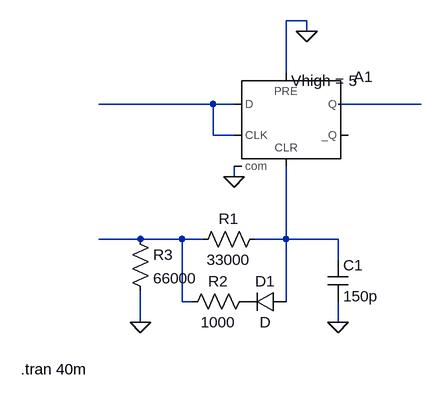
[diagram p0: schematic Draft3.asc]
Draft3.asc, the LTspice schematic file:
Version 4.1
SHEET 1 880 680
WIRE 496 -128 464 -128
WIRE 496 -112 496 -128
WIRE 464 -48 464 -128
WIRE 352 0 176 0
WIRE 384 0 352 0
WIRE 672 0 544 0
WIRE 352 48 352 0
WIRE 384 48 352 48
WIRE 384 112 384 96
WIRE 240 208 176 208
WIRE 304 208 240 208
WIRE 336 208 304 208
WIRE 464 208 464 96
WIRE 464 208 416 208
WIRE 544 208 464 208
WIRE 544 240 544 208
WIRE 304 304 304 208
WIRE 320 304 304 304
WIRE 464 304 464 208
WIRE 240 336 240 288
WIRE 544 336 544 304
FLAG 384 112 0
FLAG 496 -112 0
FLAG 544 336 0
FLAG 240 336 0
SYMBOL Digital\\dflop 464 -48 R0
WINDOW 3 8 12 Left 2
SYMATTR InstName A1
SYMATTR Value Vhigh = 5
SYMBOL res 432 192 R90
WINDOW 0 0 56 VBottom 2
WINDOW 3 32 56 VTop 2
SYMATTR InstName R1
SYMATTR Value 33000
SYMBOL res 416 288 R90
WINDOW 0 0 56 VBottom 2
WINDOW 3 32 56 VTop 2
SYMATTR InstName R2
SYMATTR Value 1000
SYMBOL diode 464 288 R90
WINDOW 0 0 32 VBottom 2
WINDOW 3 32 32 VTop 2
SYMATTR InstName D1
SYMBOL cap 528 240 R0
SYMATTR InstName C1
SYMATTR Value 150p
SYMBOL res 224 192 R0
SYMATTR InstName R3
SYMATTR Value 66000
TEXT 56 408 Left 2 !.tran 40m

The netlist it stands for:
* Draft3.asc
A1 N001 0 N001 0 N004 0 N002 0 DFLOP Vhigh = 5
R1 N004 N003 33000
R2 P001 N003 1000
D1 N004 P001 D
C1 N004 0 150p
R3 N003 0 66000
.model D D
.lib standard.dio
.tran 40m
.backanno
.end